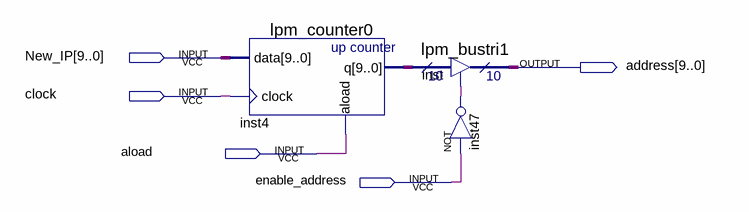
[diagram p0: schematic sheet]
// Quartus schematic IP.bdf as structural Verilog: 3 symbols, 5 pins
module IP (
  input  [9:0] New_IP,
  input  clock,
  input  aload,
  input  enable_address,
  output [9:0] address
);

  wire inst47_out;
  wire [9:0] inst4_q;

  lpm_counter0 inst4 (.data(New_IP), .clock(clock), .aload(aload), .q(inst4_q));
  lpm_bustri1 inst (.enabledt(inst47_out), .data(inst4_q), .tridata(address));
  not inst47 (inst47_out, enable_address);
endmodule
